# Altium schematic sheet Main_revB3.SchDoc
size A3; SheetNumber: 1; SheetTotal: 4
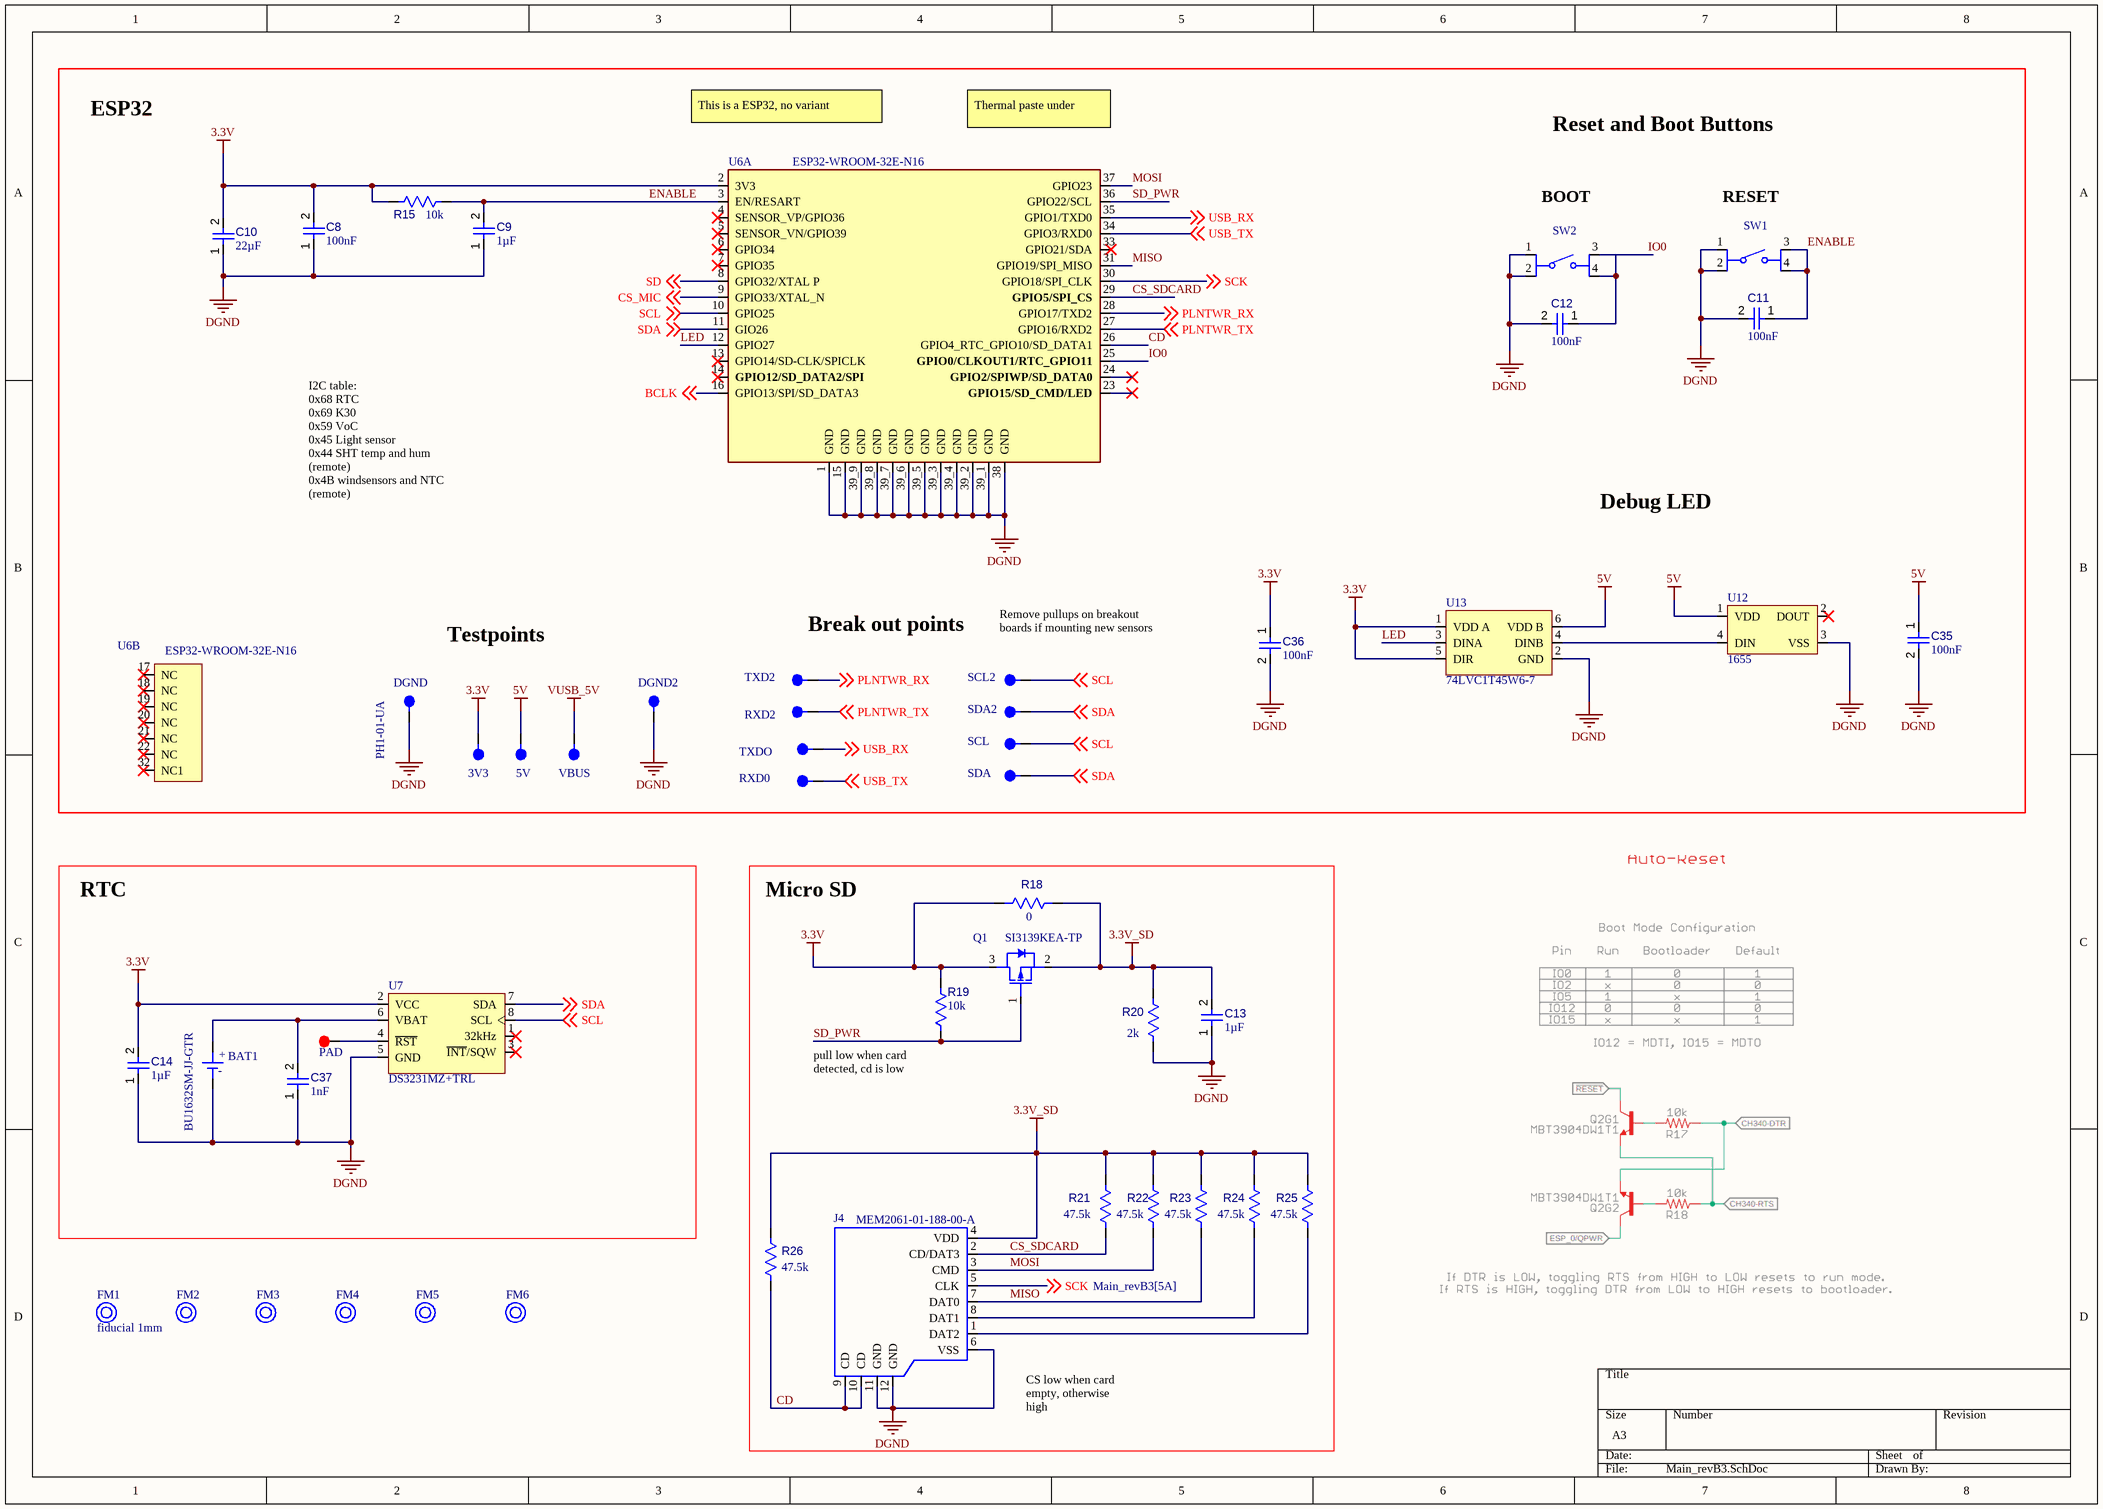
[diagram p0: Main_revB3.SchDoc]

## Parts
3V3  PH1-01-UA  [FP-PH1-01-UA-MFG]  (value not drawn)  (no BOM)
5V  PH1-01-UA  [FP-PH1-01-UA-MFG]  (value not drawn)  (no BOM)
BAT1  BU1632SM-JJ-GTR  [BU1632SM-JJ-GTR-Footprint-1]
C8  value 100nF  [MANUF_CAP_0603]  (hidden comment: CC0603KRX7R7BB104)
C9  value 1µF  [MANUF_CAP_0603]  (hidden comment: CL10B105KA8NFNC)
C10  value 22µF  [FP-GRM21B-0_2-e0_2_0_7-MFG]  (hidden comment: GRM21BZ71A226ME15L)
C11  value 100nF  [MANUF_CAP_0603]  (hidden comment: CC0603KRX7R7BB104)
C12  value 100nF  [MANUF_CAP_0603]  (hidden comment: CC0603KRX7R7BB104)
C13  value 1µF  [MANUF_CAP_0603]  (hidden comment: CL10B105KA8NFNC)
C14  value 1µF  [MANUF_CAP_0603]  (hidden comment: CL10B105KA8NFNC)
C35  value 100nF  [MANUF_CAP_0603]  (hidden comment: CC0603KRX7R7BB104)
C36  value 100nF  [MANUF_CAP_0603]  (hidden comment: CC0603KRX7R7BB104)
C37  value 1nF  [0805]  (hidden comment: C0805C102K2GEC7800)
DGND  PH1-01-UA  [FP-PH1-01-UA-MFG]  (no BOM)
DGND2  PH1-01-UA  [FP-PH1-01-UA-MFG]  (value not drawn)  (no BOM)
FM1  fiducial 1mm  [fiducial 1mm-Footprint-1]  (no BOM)
FM2  fiducial 1mm  [fiducial 1mm-Footprint-1]  (value not drawn)  (no BOM)
FM3  fiducial 1mm  [fiducial 1mm-Footprint-1]  (value not drawn)  (no BOM)
FM4  fiducial 1mm  [fiducial 1mm-Footprint-1]  (value not drawn)  (no BOM)
FM5  fiducial 1mm  [fiducial 1mm-Footprint-1]  (value not drawn)  (no BOM)
FM6  fiducial 1mm  [fiducial 1mm-Footprint-1]  (value not drawn)  (no BOM)
J4  MEM2061-01-188-00-A  [MEM2061-01-188-00-A-Footprint-1]
P1  PAD  [PAD-Footprint-1]  (no BOM)
Q1  SI3139KEA-TP  [SOT50P160X80-3N]
R15  value 10k  [MANUF_RES_0603]  (hidden comment: RC0603FR-0710KL)
R18  value 0  [MANUF_RES_0603]  (hidden comment: Resistor 0R +/- 5% 0603 100 mW)
R19  value 10k  [MANUF_RES_0603]  (hidden comment: RC0603FR-0710KL)
R20  value 2k  [MANUF_RES_0603]  (hidden comment: ERJ-3EKF2001V)
R21  value 47.5k  [MANUF_RES_0603]  (hidden comment: CRCW060347K5FKEAHP)
R22  value 47.5k  [MANUF_RES_0603]  (hidden comment: CRCW060347K5FKEAHP)
R23  value 47.5k  [MANUF_RES_0603]  (hidden comment: CRCW060347K5FKEAHP)
R24  value 47.5k  [MANUF_RES_0603]  (hidden comment: CRCW060347K5FKEAHP)
R25  value 47.5k  [MANUF_RES_0603]  (hidden comment: CRCW060347K5FKEAHP)
R26  value 47.5k  [MANUF_RES_0603]  (hidden comment: CRCW060347K5FKEAHP)
RXD0  PH1-01-UA  [FP-PH1-01-UA-MFG]  (value not drawn)  (no BOM)
RXD2  PH1-01-UA  [FP-PH1-01-UA-MFG]  (value not drawn)  (no BOM)
SCL  PH1-01-UA  [FP-PH1-01-UA-MFG]  (value not drawn)  (no BOM)
SCL2  PH1-01-UA  [FP-PH1-01-UA-MFG]  (value not drawn)  (no BOM)
SDA  PH1-01-UA  [FP-PH1-01-UA-MFG]  (value not drawn)  (no BOM)
SDA2  PH1-01-UA  [FP-PH1-01-UA-MFG]  (value not drawn)  (no BOM)
SW1  PTS526SK15SMTR2LFS  [FP-PTS526SK15SMTR2LFS-MFG]  (value not drawn)
SW2  PTS526SK15SMTR2LFS  [FP-PTS526SK15SMTR2LFS-MFG]  (value not drawn)
TXD2  PH1-01-UA  [FP-PH1-01-UA-MFG]  (value not drawn)  (no BOM)
TXDO  PH1-01-UA  [FP-PH1-01-UA-MFG]  (value not drawn)  (no BOM)
U6  ESP32-WROOM-32E-N16  [ESP32-WROOM-32E-N16-Footprint-1]  (parts A,B of 2)
U7  DS3231MZ+TRL  [S8MK+1_M]
U12  1655  [ADA-RGB-1655_V]
U13  74LVC1T45W6-7  [SOT95P285X130-6N]
VBUS  PH1-01-UA  [FP-PH1-01-UA-MFG]  (value not drawn)  (no BOM)

## Blocks framed on the sheet
RTC: BAT1 C14 C37 P1 U7
Micro SD: C13 J4 Q1 R18-R26

## Nets
3.3V: 3V3.1 C8.2 C10.2 C14.2 C36.1 Q1.3(D) R15.2 R18.2 R19.1 U6.2(3V3) U7.2(VCC) U13.1(VDD_A) U13.5(DIR)
3.3V_SD: C13.2 J4.4(VDD) Q1.2(S) R18.1 R20.1 R21.2 R22.2 R23.2 R24.2 R25.2 R26.2
5V: 5V.1 C35.1 U12.1(VDD) U13.6(VDD_B)
DGND: BAT1.2(-) C8.1 C9.1 C10.1 C11.2 C12.2 C13.1 C14.1 C35.2 C36.2 C37.1 DGND.1 DGND2.1 J4.6(VSS) J4.11(GND) J4.12(GND) R20.2 SW1.1 SW1.2 SW2.1 SW2.2 U6.1(GND) U6.15(GND) U6.38(GND) U6.39_1(GND) U6.39_2(GND) U6.39_3(GND) U6.39_4(GND) U6.39_5(GND) U6.39_6(GND) U6.39_7(GND) U6.39_8(GND) U6.39_9(GND) U7.5(GND) U12.3(VSS) U13.2(GND)
VUSB_5V: VBUS.1
BCLK: U6.16(GPIO13/SPI/SD_DATA3) ; off-sheet BCLK
CD: J4.9(CD) J4.10(CD) R26.1 U6.26(GPIO4_RTC_GPIO10/SD_DATA1)
CS_MIC: U6.9(GPIO33/XTAL_N) ; off-sheet CS_MIC
CS_SDCARD: J4.2(CD/DAT3) R21.1 U6.29(GPIO5/SPI_CS)
ENABLE: C9.2 C11.1 R15.1 SW1.3 SW1.4 U6.3(EN/RESART)
IO0: C12.1 SW2.3 SW2.4 U6.25(GPIO0/CLKOUT1/RTC_GPIO11)
LED: U6.12(GPIO27) U13.3(DINA)
MISO: J4.7(DAT0) R23.1 U6.31(GPIO19/SPI_MISO)
MOSI: J4.3(CMD) R22.1 U6.37(GPIO23)
PLNTWR_RX: TXD2.1 U6.28(GPIO17/TXD2) ; off-sheet PLNTWR_RX
PLNTWR_TX: RXD2.1 U6.27(GPIO16/RXD2) ; off-sheet PLNTWR_TX
SCK: J4.5(CLK) U6.30(GPIO18/SPI_CLK) ; off-sheet SCK
SCL: SCL.1 SCL2.1 U6.10(GPIO25) U7.8(SCL) ; off-sheet SCL
SD: U6.8(GPIO32/XTAL_P) ; off-sheet SD
SD_PWR: Q1.1(G) R19.2 U6.36(GPIO22/SCL)
SDA: SDA.1 SDA2.1 U6.11(GIO26) U7.7(SDA) ; off-sheet SDA
USB_RX: TXDO.1 U6.35(GPIO1/TXD0) ; off-sheet USB_RX
USB_TX: RXD0.1 U6.34(GPIO3/RXD0) ; off-sheet USB_TX
NetBAT1_1: BAT1.1(+) C37.2 U7.6(VBAT)
NetJ4_1: J4.1(DAT2) R25.1
NetJ4_8: J4.8(DAT1) R24.1
NetP1_1: P1.1 U7.4(~{RST})
NetU12_4: U12.4(DIN) U13.4(DINB)

Not connected (* = marked no-connect by the designer): U6 4(SENSOR_VP/GPIO36)* 5(SENSOR_VN/GPIO39)* 6(GPIO34)* 7(GPIO35)* 13(GPIO14/SD-CLK/SPICLK)* 14(GPIO12/SD_DATA2/SPI)* 17(NC)* 18(NC)* 19(NC)* 20(NC)* 21(NC)* 22(NC)* 23(GPIO15/SD_CMD/LED)* 24(GPIO2/SPIWP/SD_DATA0)* 32(NC1)* 33(GPIO21/SDA)*; U7 1(32kHz)* 3(~{INT}/SQW)*; U12 2(DOUT)*

## Notes on the sheet
- ESP32
- This is a ESP32, no variant
- Thermal paste under
- Reset and Boot Buttons
- (near SW2) BOOT
- (near SW1) RESET
- Debug LED
- I2C table:
  0x68 RTC
  0x69 K30
  0x59 VoC
  0x45 Light sensor
  0x44 SHT temp and hum (remote)
  0x4B windsensors and NTC (remote)
- Testpoints
- Break out points
- (near SCL2) Remove pullups on breakout boards if mounting new sensors
- (near R19) pull low when card detected, cd is low
- CS low when card empty, otherwise high

## Library data of the parts
3V3 5V DGND DGND2 RXD0 RXD2 SCL SCL2 SDA SDA2 TXD2 TXDO VBUS = CMP-002-00083-1: Conn Unshrouded Header HDR 1 POS 2.54mm Solder ST Thru-Hole Bag
BAT1 = CMP-002-00085-2: battery holder cr1632
C8 C11 C12 C35 C36 = CMP-001-00099-4: Ceramic Capacitor, Multilayer, Ceramic, 16V, 10% +Tol, 10% -Tol, X7R, 15% TC, 0.1uF, Surface Mount, 0603; Pins: 2; Min Operating Temperature: -55°C; Max Operating Temperature: 125°C; Case/Package: 0603; RoHS Compliant: Yes; Mounting Technology: Surface Mount; Capacitor Type: Ceramic
C9 C13 C14 = CMP-001-00098-2: Ceramic Capacitor, Multilayer, Ceramic, 25V, 10% +Tol, 10% -Tol, X7R, 15% TC, 1uF, Surface Mount, 0603; Pins: 2; Mounting Technology: Surface Mount; Min Operating Temperature: -55°C; Case/Package: 0603; Capacitor Type: Ceramic; RoHS Compliant: Yes; Max Operating Temperature: 125°C
C10 = CMP-001-00091-2: Ceramic Capacitor, Multilayer, Ceramic, 10V, 20% +Tol, 20% -Tol, X7R, 15% TC, 22uF, Surface Mount, 0805; Capacitor Type: Ceramic; Min Operating Temperature: -55°C; Pins: 2; Max Operating Temperature: 125°C; Case/Package: 0805; Mounting Technology: Surface Mount; RoHS Compliant: Yes
C37 = CMP-001-00100-1: ESD SMD Comm C0G 0805 (2012Metric) Ceramic Capacitor 0.079Lx0.049W 2.00mmx1.25mm C0G NP0 ±10% 1000pF; Tolerance: 10%; Case/Package: 0805
FM1-FM6 = CMP-00030-00004-9: fiducial marker 2D
J4 = CMP-002-00080-1: Micro SD card, push in, push out; Connector Type: PCB; RoHS Compliant: Yes
P1 = CMP-00030-00002-1: a pad to pull out pins
Q1 = CMP-013-00037-1: P-Channel 20 V 600 mA 150 mW Surface Mount Mosfet - SOT-523
R15 R19 = CMP-009-00204-2: Fixed Resistor, Metal Glaze/thick Film, 0.1W, 10000ohm, 75V, 1% +/-Tol, 100ppm/Cel, Surface Mount, 0603; Power: 100mW; Pins: 2; Max Operating Temperature: 155°C; Case/Package: 0603; RoHS Compliant: Yes; Tolerance: 1%; Min Operating Temperature: -55°C; Mounting Technology: Surface Mount
R18 = CMP-009-00006-8: Chip Resistor, 0 Ohm, 0.1 W, -55 to 155 degC, 0603 (1608 Metric); Power: 100mW; Voltage Rating: 50V; Max Operating Temperature: 155°C; RoHS Compliant: True; Mounting Technology: SM; Case/Package: 0603; Min Operating Temperature: -55°C; Tolerance: 5%; Pins: 2
R20 = CMP-009-00207-2: Fixed Resistor, Metal Glaze/thick Film, 0.1W, 2000ohm, 75V, 1% +/-Tol, 100ppm/Cel, Surface Mount, 0603; Power: 100mW; RoHS Compliant: Yes; Pins: 2; Max Operating Temperature: 155°C; Case/Package: 0603; Tolerance: 1%; Mounting Technology: Surface Mount; Min Operating Temperature: -55°C
R21-R26 = CMP-009-00197-3: Fixed Resistor, Metal Glaze/thick Film, 0.33W, 47500ohm, 75V, 1% +/-Tol, 100ppm/Cel, Surface Mount, 0603; Power: 250mW; Min Operating Temperature: -55°C; RoHS Compliant: Yes; Mounting Technology: Surface Mount; Tolerance: 1%; Case/Package: 0603; Max Operating Temperature: 155°C; Pins: 2
SW1 SW2 = CMP-011-00013-2: Switch Tactile N.O. SPST Round Button Gull Wing 0.05A 12VDC 200000Cycles 2.45N SMD T/R
U6 = CMP-020-00023-6: WiFi-Module 802.11/BT 2, 4-2, 5GHz 150Mb/s
U7 = CMP-00023-00005-1: Real Time Clock, Non-Volatile, 1 Timer(s), CMOS, PDSO8; RoHS Compliant: Yes; Max Operating Temperature: 85°C; Min Operating Temperature: -45°C; Case/Package: SOP; Pins: 8
U12 = CMP-00026-00001-3: WS2812B 5050 RGB LED WITH INTEGRATED DRIVER CHIP PACK OF 10
U13 = CMP-015-00009-1: Bus Transceiver, LVC/LCX/Z Series, 1-Func, 1-Bit, True Output, CMOS, PDSO6; Max Supply Voltage: 5.5V; Nominal Supply Voltage: 3.3V; Min Supply Voltage: 1.65V; RoHS Compliant: Yes; Case/Package: LSSOP; Min Operating Temperature: -40°C; Max Operating Temperature: 125°C; Pins: 6